# EAGLE design FTDI mini-usb (EAGLE 6.1)
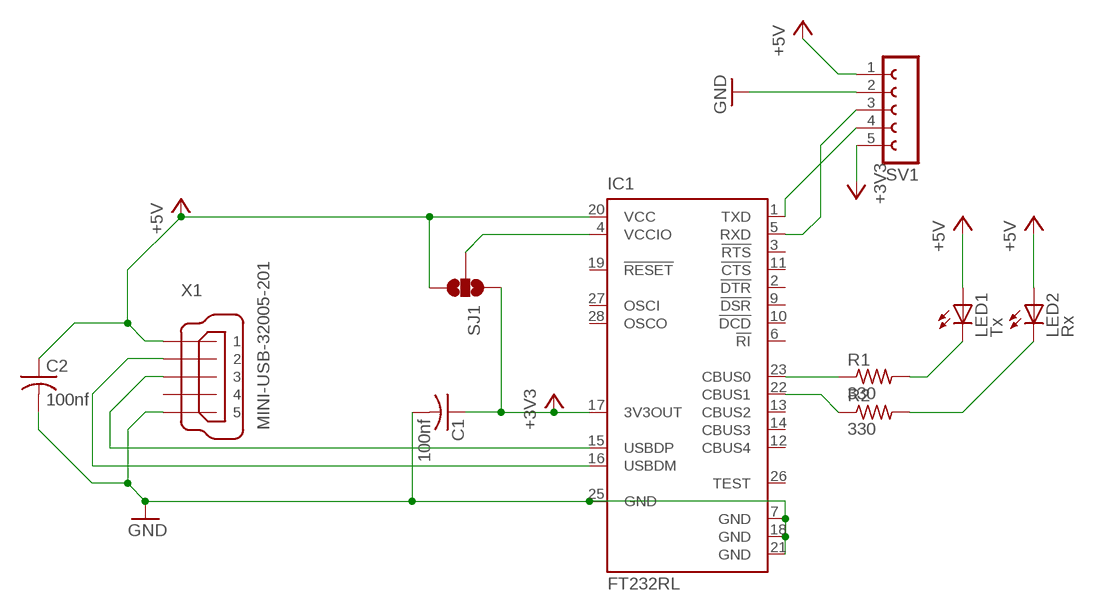
[diagram p0: schematic, sheet 1]

## Parts
C1  100nf  C-USC0805K  [C0805K]
C2  100nf  C-USC0805K  [C0805K]
IC1  FT232RL  [SSOP28]
LED1  Tx  LEDCHIPLED_0805  [CHIPLED_0805]
LED2  Rx  LEDCHIPLED_0805  [CHIPLED_0805]
R1  330  R-US_R0805W  [R0805W]
R2  330  R-US_R0805W  [R0805W]
SJ1  SOLDERJUMPER_2WAYS  [SJ_3]
SV1  FE05-1  [FE05-1]
X1  MINI-USB-32005-201  [32005-201]

## Nets
+3V3: C1.1 IC1.17(3V3OUT) SJ1.1 SV1.5
+5V: C2.1 IC1.20(VCC) LED1.A LED2.A SJ1.3 SV1.1 X1.1
GND: C1.2 C2.2 IC1.7(GND) IC1.18(GND) IC1.21(GND) IC1.25(GND) SV1.2 X1.5
N$3: IC1.16(USBDM) X1.2
N$4: IC1.15(USBDP) X1.3
N$5: IC1.4(VCCIO) SJ1.2
N$8: IC1.23(CBUS0) R1.1
N$9: IC1.22(CBUS1) R2.1
N$10: LED1.C R1.2
N$11: LED2.C R2.2
N$12: IC1.5(RXD) SV1.3
N$13: IC1.1(TXD) SV1.4
Unconnected: IC1.2(!DTR) IC1.3(!RTS) IC1.6(!RI) IC1.9(!DSR) IC1.10(!DCD) IC1.11(!CTS) IC1.12(CBUS4) IC1.13(CBUS2) IC1.14(CBUS3) IC1.19(!RESET) IC1.26(TEST) IC1.27(OSCI) IC1.28(OSCO) X1.4

## Library data of the parts
C1 C2 = resistor:C-US: CAPACITOR, American symbol
IC1 = ftdichip:FT232R: Source: http://www.ftdichip.com/Documents/DataSheets/DS_FT232R_v104.pdf; MPN: FT232RL; OC_FARNELL: 1146032; OC_NEWARK: 91K9918
LED1 LED2 = led:LED: LED OSRAM: - CHIPLED LG R971, LG N971, LY N971, LG Q971, LY Q971, LO R971, LY R971 LH N974, LH R974 LS Q976, LO Q976, LY Q976 LO Q996 - Hyper CHIPLED LW Q18S LB Q993, LB Q99A, LB R99A - SideLED LS A670, LO A670, LY A670, LG A670, LP A670 LB A673, LV A673, LT A673, LW A673 LH A674 LY A675 LS A676, LA A676, LO A676, LY A676, LW A676 LS A679, LY A679, LG A679 - Hyper Micro SIDELED® LS Y876, LA Y876, LO Y876, LY Y876 LT Y87S - SmartLED LW L88C, LW L88S LB L89C, LB L89S, LG L890 LS L89K, LO L89K, LY L89K LS L896, LA L896, LO L896, LY L896 - TOPLED LS T670, LO T670, LY T670, LG T670, LP T670 LSG T670, LSP T670, LSY T670, LOP T670, LYG T670 LG T671, LOG T671, LSG T671 LB T673, LV T673, LT T673, LW T673 LH T674 LS T676, LA T676, LO T676, LY T676, LB T676, LH T676, LSB T676, LW T676 LB T67C, LV T67C, LT T67C, LS T67K, LO T67K, LY T67K, LW E67C LS E67B, LA E67B, LO E67B, LY E67B, LB E67C, LV E67C, LT E67C LW T67C LS T679, LY T679, LG T679 LS T770, LO T770, LY T770, LG T770, LP T770 LB T773, LV T773, LT T773, LW T773 LH T774 LS E675, LA E675, LY E675, LS T675 LS T776, LA T776, LO T776, LY T776, LB T776 LHGB T686 LT T68C, LB T68C - Hyper Mini TOPLED® LB M676 - Mini TOPLED Santana® LG M470 LS M47K, LO M47K, LY M47K Source: http://www.osram.convergy.de LUXEON: - LUMILED® LXK2-PW12-R00, LXK2-PW12-S00, LXK2-PW14-U00, LXK2-PW14-V00 LXK2-PM12-R00, LXK2-PM12-S00, LXK2-PM14-U00 LXK2-PE12-Q00, LXK2-PE12-R00, LXK2-PE12-S00, LXK2-PE14-T00, LXK2-PE14-U00 LXK2-PB12-K00, LXK2-PB12-L00, LXK2-PB12-M00, LXK2-PB14-N00, LXK2-PB14-P00, LXK2-PB14-Q00 LXK2-PR12-L00, LXK2-PR12-M00, LXK2-PR14-Q00, LXK2-PR14-R00 LXK2-PD12-Q00, LXK2-PD12-R00, LXK2-PD12-S00 LXK2-PH12-R00, LXK2-PH12-S00 LXK2-PL12-P00, LXK2-PL12-Q00, LXK2-PL12-R00 Source: www.luxeon.com KINGBRIGHT: KA-3528ASYC Source: www.kingbright.com
R1 R2 = resistor:R-US_: RESISTOR, American symbol
SJ1 = SparkFun:SOLDERJUMPER_2WAY: Solder Jumper 2 way solder jumper
SV1 = con-lsta:FE05-1: FEMALE HEADER; OC_FARNELL: unknown; OC_NEWARK: unknown
X1 = con-cypressindustries:MINI-USB-: MINI USB-B Conector Source: www.cypressindustries.com; OC_FARNELL: unknown; OC_NEWARK: unknown

## Board
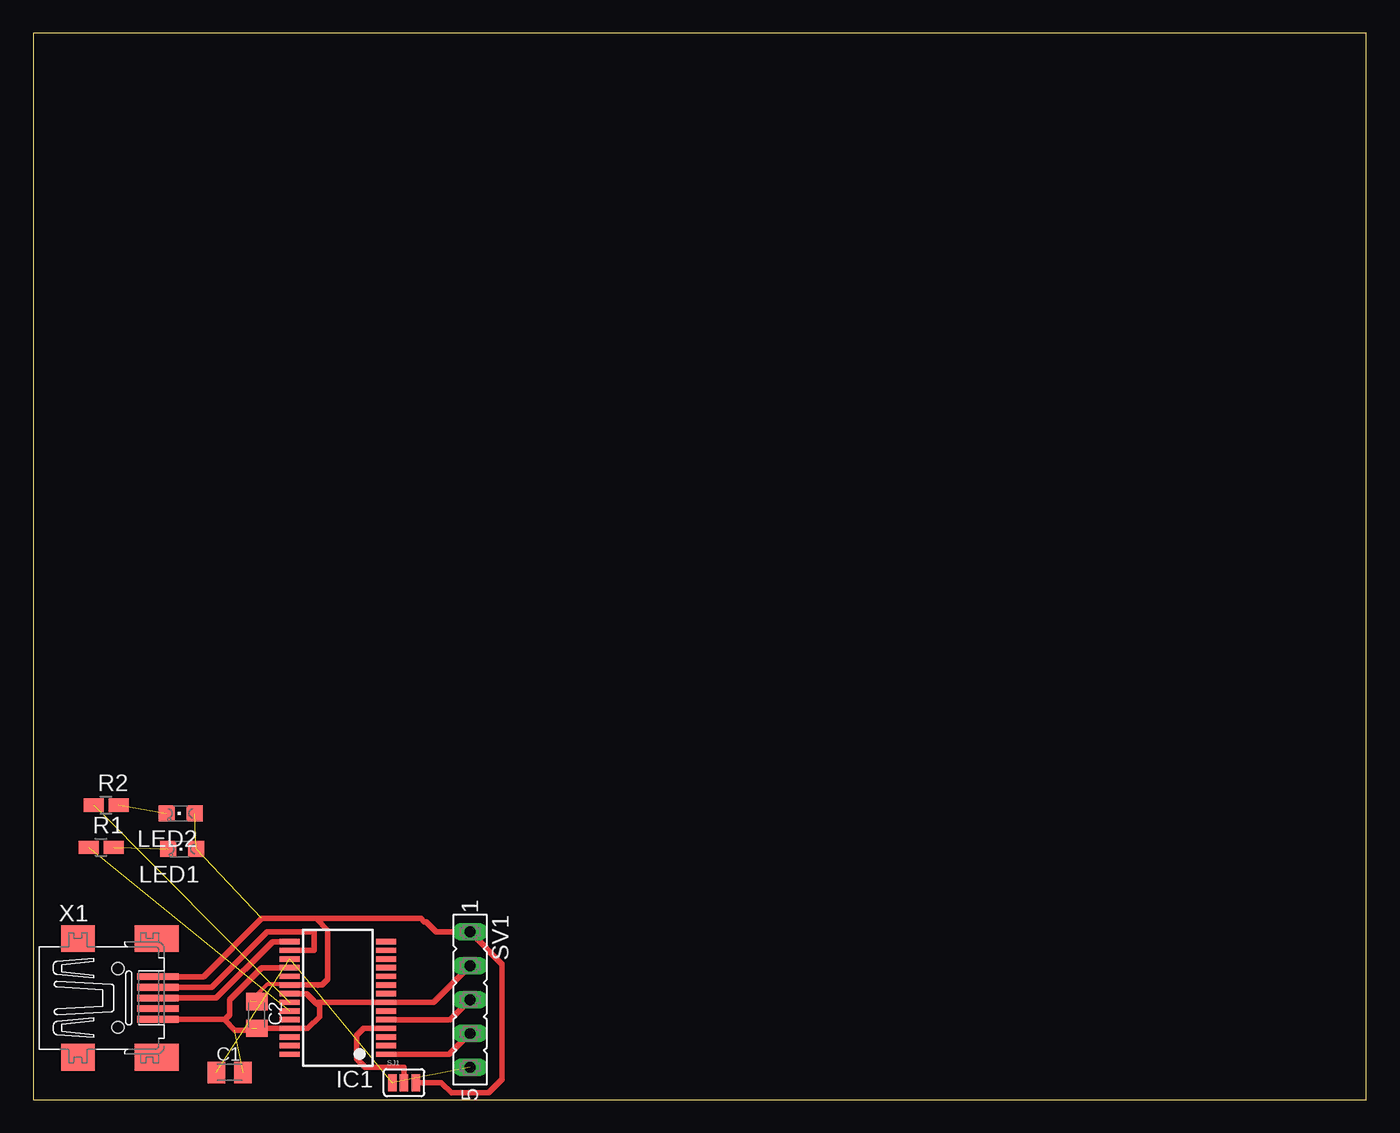
[diagram p1: board, top side]

Size 100 x 80 mm. Coordinates in mm from the lower left corner, seen from the top.
Outline: 0,0 100,0 100,80 0,80 0,0
Copper layers (1*16): Top 0.035mm / dielectric 1.5mm / Bottom 0.035mm
Design rules: minimum track width 10mil, minimum drill 24mil, track to track 8mil, track to pad 8mil, pad to pad 8mil, via to via 8mil, smd to smd 8mil, copper to edge 40mil, drill to drill 8mil, minimum pad ring 10mil, minimum via ring 8mil, stop-mask expansion 4mil, vias tented up to drill 0mil, thermal gap 10mil

### Footprints (pad centres in the part's own frame; a part is rotated, then mirrored left to right if it is on the bottom)
C0805K = smd 1.3 x 1.6: 1 -1,0; 2 1,0
SSOP28 = smd 0.4 x 1.5: 1 -4.225,-3.625; 2 -3.575,-3.625; 3 -2.925,-3.625; 4 -2.275,-3.625; 5 -1.625,-3.625; 6 -0.975,-3.625; 7 -0.325,-3.625; 8 0.325,-3.625; 9 0.975,-3.625; 10 1.625,-3.625; 11 2.275,-3.625; 12 2.925,-3.625; 13 3.575,-3.625; 14 4.225,-3.625; 15 4.225,3.625; 16 3.575,3.625; 17 2.925,3.625; 18 2.275,3.625; 19 1.625,3.625; 20 0.975,3.625; 21 0.325,3.625; 22 -0.325,3.625; 23 -0.975,3.625; 24 -1.625,3.625; 25 -2.275,3.625; 26 -2.925,3.625; 27 -3.575,3.625; 28 -4.225,3.625
CHIPLED_0805 = smd 1.2 x 1.2: A 0,-1.05; C 0,1.05
R0805W = smd 1.5 x 1: 1 -0.94,0; 2 0.94,0
SJ_3 = smd 0.635 x 1.27: 1 -0.889,0; 2 0,0; 3 0.889,0
FE05-1 = drill 0.813 long: 1 -5.08,0; 2 -2.54,0; 3 0,0; 4 2.54,0; 5 5.08,0
32005-201 = smd 3.1 x 0.5: 1 3,1.6; 2 3,0.8; 3 3,0; 4 3,-0.8; 5 3,-1.6 | smd 2.5 x 2: M1 -3,-4.45; M2 -3,4.45 | smd 3.3 x 2: M3 2.9,4.45; M4 2.9,-4.45 | hole 0.9: 0,2.2; 0,-2.2

### Placement (x,y rotation side)
C1  14.73,2.03 0 top
C2  16.76,6.35 270 top
IC1  22.86,7.62 90 top
LED1  11.18,18.8 90 top
LED2  11.05,21.46 90 top
R1  5.08,18.92 0 top
R2  5.46,22.1 0 top
SJ1  27.81,1.27 0 top
SV1  32.77,7.49 270 top
X1  6.35,7.62 0 top

### Tracks (layer width: path | path; a pad name or v marks a point on that pad's centre or on a via)
+3V3  (3 unrouted)
+5V  (3 unrouted)
  Top 0.305: 21.72,8.64 21.46,8.64 | 21.34,8.51 21.46,8.64 | 21.46,8.64 17.53,8.64 16.26,7.37
  Top 0.406: X1.1 12.78,9.22 17.14,13.59 21.21,13.59 | 21.21,13.59 22.1,12.7 22.1,9.02 21.72,8.64 21.68,8.6 IC1.20 | 21.21,13.59 29.08,13.59 29.34,13.34 29.46,13.34 30.23,12.57 SV1.1 35.18,10.16 35.18,1.52 34.16,0.51 31.37,0.51 30.61,1.27 SJ1.3
GND  (2 unrouted)
  Top 0.406: C2.2 IC1.25 19.25,5.33 20.57,5.33 21.46,6.22 21.46,6.99 21.27,7.18 | X1.5 14.3,6.02 14.35,5.97 | 14.35,5.97 15.11,5.21 16.26,5.21 16.38,5.33 16.26,5.33 | IC1.18 17.13,9.89 14.73,7.49 14.73,6.35 14.35,5.97 | IC1.21 20.5,7.95 21.27,7.18 | 21.27,7.18 21.39,7.29 IC1.7 30.03,7.29 SV1.2
N$3
  Top 0.406: X1.2 13.37,8.42 17.53,12.57 21.08,12.57 21.08,11.18 19.25,11.18 IC1.16
N$4
  Top 0.406: X1.3 13.72,7.62 17.94,11.85 IC1.15
N$5
  Top 0.406: SJ1.2 27.81,2.41 24.89,2.41 24.26,3.05 24.26,4.83 24.77,5.33 26.47,5.33 IC1.4
N$8  (1 unrouted)
N$9  (1 unrouted)
N$10  (1 unrouted)
N$11  (1 unrouted)
N$12
  Top 0.406: IC1.5 31.27,6 SV1.3
N$13
  Top 0.406: IC1.1 31.21,3.4 SV1.4